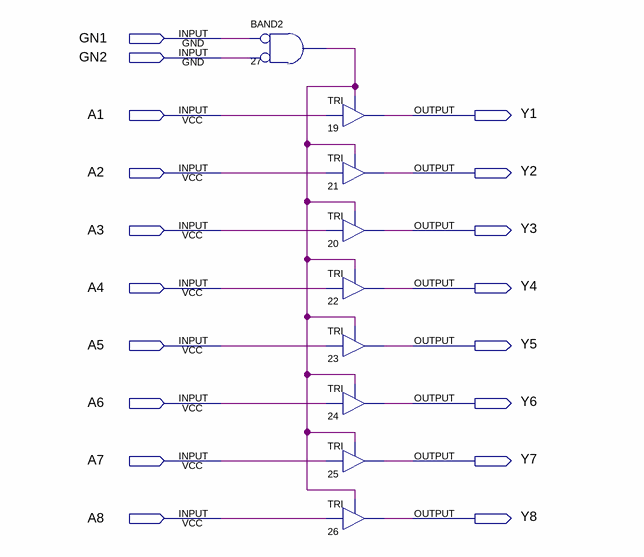
[diagram p0: schematic sheet]
// Quartus schematic ap6.bdf as structural Verilog: 9 symbols, 18 pins
module ap6 (
  input  GN1,
  input  GN2,
  input  A1,
  input  A2,
  input  A3,
  input  A4,
  input  A5,
  input  A6,
  input  A7,
  input  A8,
  output Y1,
  output Y2,
  output Y3,
  output Y4,
  output Y5,
  output Y6,
  output Y7,
  output Y8
);

  wire n27_out;

  and u_27 (n27_out, ~GN1, ~GN2);  // BAND2
  TRI u_19 (.IN(A1), .OE(n27_out), .OUT(Y1));
  TRI u_21 (.IN(A2), .OE(n27_out), .OUT(Y2));
  TRI u_20 (.IN(A3), .OE(n27_out), .OUT(Y3));
  TRI u_22 (.IN(A4), .OE(n27_out), .OUT(Y4));
  TRI u_23 (.IN(A5), .OE(n27_out), .OUT(Y5));
  TRI u_24 (.IN(A6), .OE(n27_out), .OUT(Y6));
  TRI u_25 (.IN(A7), .OE(n27_out), .OUT(Y7));
  TRI u_26 (.IN(A8), .OE(n27_out), .OUT(Y8));
endmodule
